# EAGLE design AETEL_Pocket_PoV (EAGLE 7.2.0)
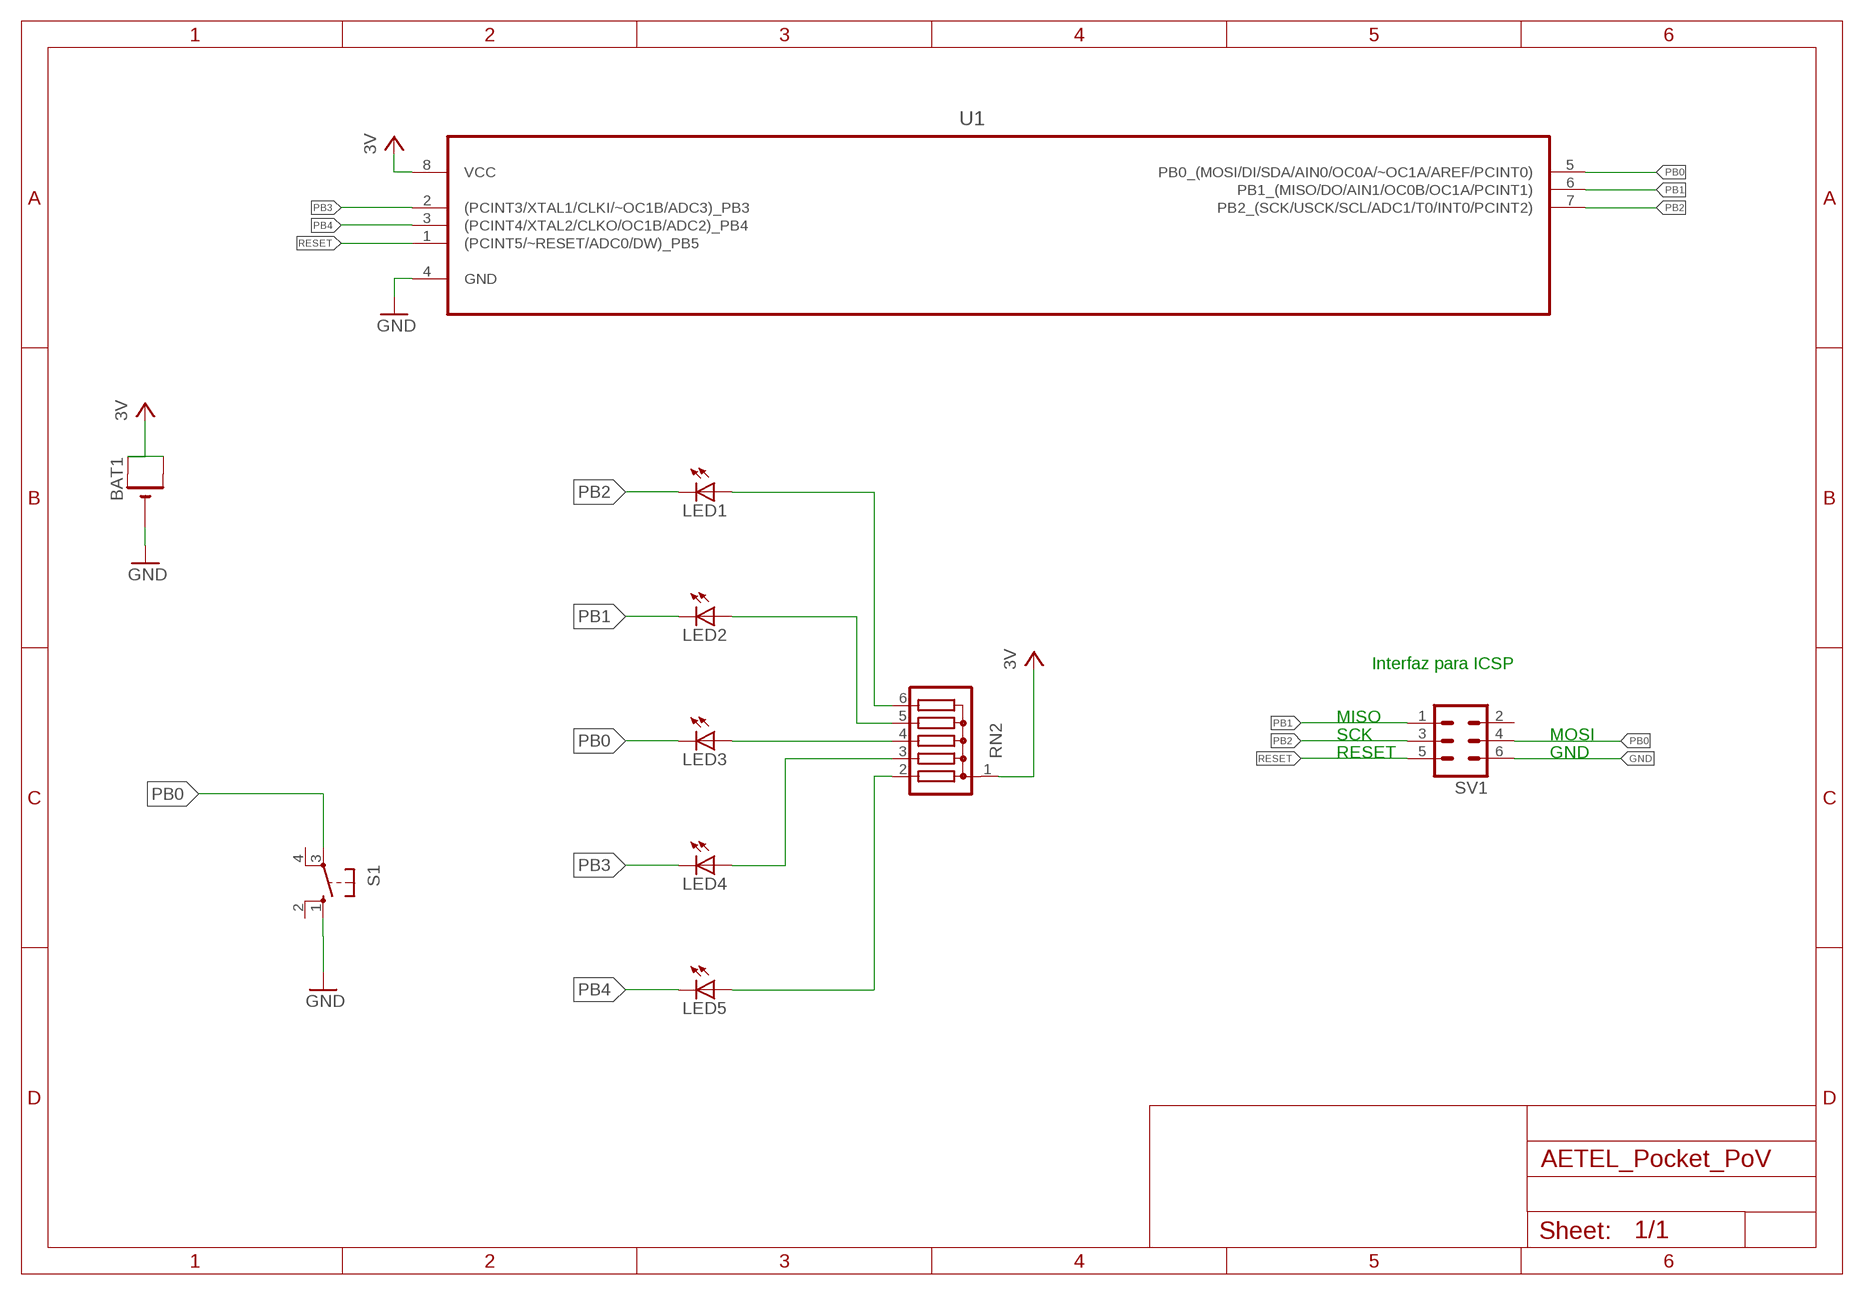
[diagram p0: schematic, sheet 1]

## Parts
BAT1  CR2032THM  [CR2032-THRU]
LED1  LEDSQUARE_LED5MM  [SQUARE_LED5MM]
LED2  LEDSQUARE_LED5MM  [SQUARE_LED5MM]
LED3  LEDSQUARE_LED5MM  [SQUARE_LED5MM]
LED4  LEDSQUARE_LED5MM  [SQUARE_LED5MM]
LED5  LEDSQUARE_LED5MM  [SQUARE_LED5MM]
RN2  G05R  [SIL6]
S1  10-XX  [B3F-10XX]
SV1  MA03-2  [MA03-2]
U1  ATTINY85-20PU  [DIP254P762X533-8]

## Nets
GND: BAT1.- S1.1(S) SV1.6 U1.4(GND)
N$1: LED3.A RN2.4
N$2: LED1.A RN2.6
N$3: LED2.A RN2.5
N$6: LED5.A RN2.2
N$7: LED4.A RN2.3
PB0: LED3.K(C) S1.3(P) SV1.4 U1.5(PB0_(MOSI/DI/SDA/AIN0/OC0A/~OC1A/AREF/PCINT0))
PB1: LED2.K(C) SV1.1 U1.6(PB1_(MISO/DO/AIN1/OC0B/OC1A/PCINT1))
PB2: LED1.K(C) SV1.3 U1.7(PB2_(SCK/USCK/SCL/ADC1/T0/INT0/PCINT2))
PB3: LED4.K(C) U1.2((PCINT3/XTAL1/CLKI/~OC1B/ADC3)_PB3)
PB4: LED5.K(C) U1.3((PCINT4/XTAL2/CLKO/OC1B/ADC2)_PB4)
RESET: SV1.5 U1.1((PCINT5/~RESET/ADC0/DW)_PB5)
VCC: BAT1.+1(+) BAT1.+2(+1) RN2.1 U1.8(VCC) ; supply symbol labelled 3V
Unconnected: S1.2(S1) S1.4(P1) SV1.2

## Notes on the sheet
- Interfaz para ICSP
- MISO
- SCK | MOSI
- RESET | GND

## Library data of the parts
BAT1 = adafruit:CR2032
LED1-LED5 = cbs_industrias_corp:LED: LED OSRAM: - CHIPLED LG R971, LG N971, LY N971, LG Q971, LY Q971, LO R971, LY R971 LH N974, LH R974 LS Q976, LO Q976, LY Q976 LO Q996 - Hyper CHIPLED LW Q18S LB Q993, LB Q99A, LB R99A - SideLED LS A670, LO A670, LY A670, LG A670, LP A670 LB A673, LV A673, LT A673, LW A673 LH A674 LY A675 LS A676, LA A676, LO A676, LY A676, LW A676 LS A679, LY A679, LG A679 - Hyper Micro SIDELED® LS Y876, LA Y876, LO Y876, LY Y876 LT Y87S - SmartLED LW L88C, LW L88S LB L89C, LB L89S, LG L890 LS L89K, LO L89K, LY L89K LS L896, LA L896, LO L896, LY L896 - TOPLED LS T670, LO T670, LY T670, LG T670, LP T670 LSG T670, LSP T670, LSY T670, LOP T670, LYG T670 LG T671, LOG T671, LSG T671 LB T673, LV T673, LT T673, LW T673 LH T674 LS T676, LA T676, LO T676, LY T676, LB T676, LH T676, LSB T676, LW T676 LB T67C, LV T67C, LT T67C, LS T67K, LO T67K, LY T67K, LW E67C LS E67B, LA E67B, LO E67B, LY E67B, LB E67C, LV E67C, LT E67C LW T67C LS T679, LY T679, LG T679 LS T770, LO T770, LY T770, LG T770, LP T770 LB T773, LV T773, LT T773, LW T773 LH T774 LS E675, LA E675, LY E675, LS T675 LS T776, LA T776, LO T776, LY T776, LB T776 LHGB T686 LT T68C, LB T68C - Hyper Mini TOPLED® LB M676 - Mini TOPLED Santana® LG M470 LS M47K, LO M47K, LY M47K Source: http://www.osram.convergy.de LUXEON: - LUMILED® LXK2-PW12-R00, LXK2-PW12-S00, LXK2-PW14-U00, LXK2-PW14-V00 LXK2-PM12-R00, LXK2-PM12-S00, LXK2-PM14-U00 LXK2-PE12-Q00, LXK2-PE12-R00, LXK2-PE12-S00, LXK2-PE14-T00, LXK2-PE14-U00 LXK2-PB12-K00, LXK2-PB12-L00, LXK2-PB12-M00, LXK2-PB14-N00, LXK2-PB14-P00, LXK2-PB14-Q00 LXK2-PR12-L00, LXK2-PR12-M00, LXK2-PR14-Q00, LXK2-PR14-R00 LXK2-PD12-Q00, LXK2-PD12-R00, LXK2-PD12-S00 LXK2-PH12-R00, LXK2-PH12-S00 LXK2-PL12-P00, LXK2-PL12-Q00, LXK2-PL12-R00 Source: www.luxeon.com KINGBRIGHT: KA-3528ASYC Source: www.kingbright.com
RN2 = resistor-sil:G05R: SIL RESISTOR; OC_FARNELL: unknown; OC_NEWARK: unknown
S1 = switch-omron:10-XX: OMRON SWITCH; MPN: B3F-1000; OC_FARNELL: 176432; OC_NEWARK: 36M3542
SV1 = con-lstb:MA03-2: PIN HEADER; OC_FARNELL: unknown; OC_NEWARK: unknown
U1 = Atmel_By_element14_Batch_1:ATTINY85-20PU: 8-bit Microcontroller with In-System Programmable Flash; MPN: ATTINY85-20PU; OC_FARNELL: 1455162; OC_NEWARK: 58M3796; PACKAGE: PDIP-8; SUPPLIER: Atmel

## Net classes
0 default: width 0.356 mm
1 power: width 0.61 mm

## Board
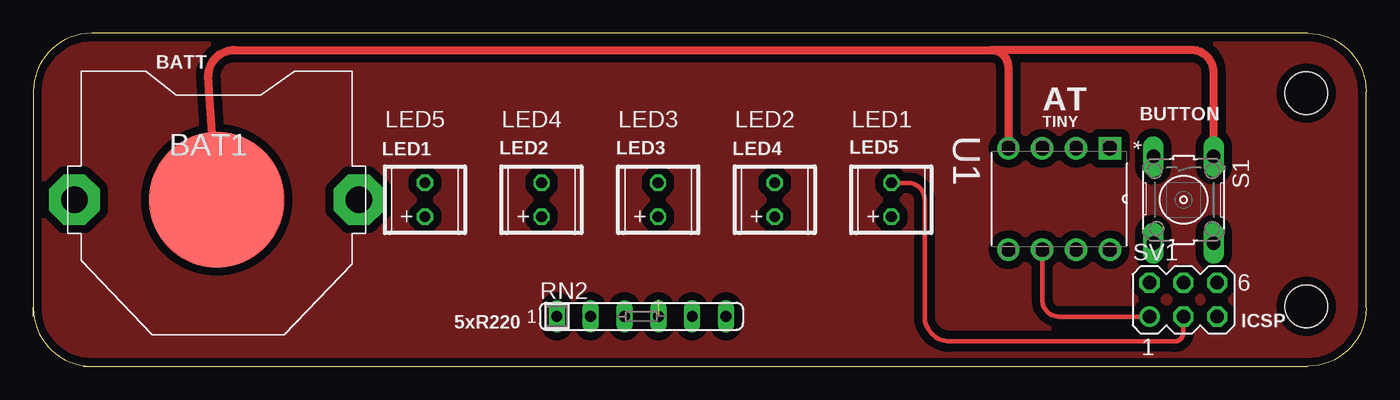
[diagram p1: board, top side]
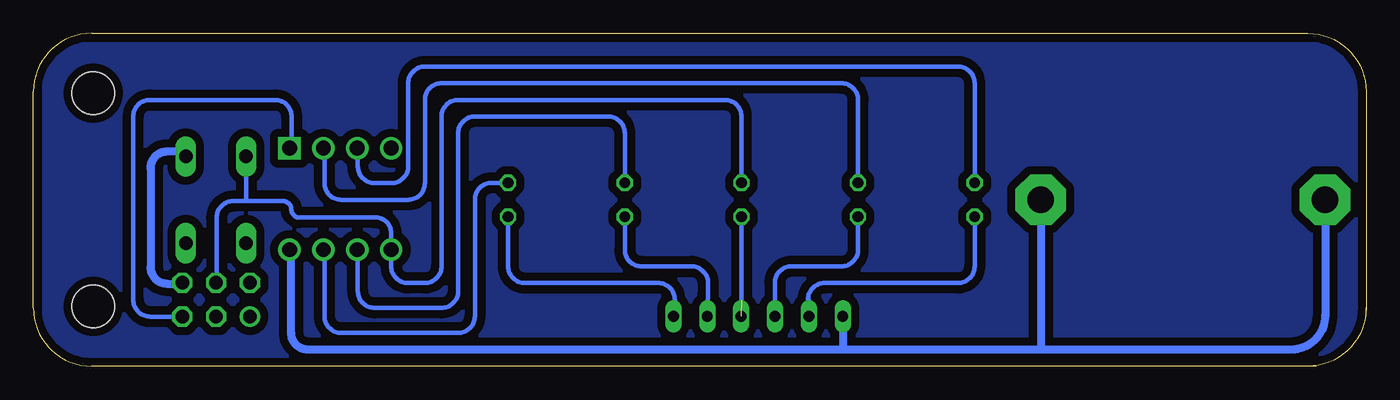
[diagram p2: board, bottom side, seen from below]

Size 100 x 25 mm. Coordinates in mm from the lower left corner, seen from the top.
Outline: 3.75,0 4.38,0
Outline: 4.38,0 95.62,0 arc90 100,4.38 100,20.62 arc90 95.62,25 4.38,25 arc90 0,20.62 0,4.38
Outline: 0,3.75 0,4.38
Outline: 0,4.38 arc90 4.38,0
Copper layers (1*16): Top 0.035mm / dielectric 1.6mm / Bottom 0.035mm
Design rules "Elecrow_2-layer_PCB_eagle_rule": minimum track width 6mil, minimum drill 12mil, track to track 6mil, track to pad 6mil, pad to pad 6mil, via to via 8mil, smd to smd 0mil, copper to edge 20mil, drill to drill 10mil, minimum pad ring 6mil, minimum via ring 6mil, stop-mask expansion 0mil, vias tented up to drill 100mil, thermal gap 10mil
Holes 3.2 mm at 95.5,20.5 95.5,4.5

### Footprints (pad centres in the part's own frame; a part is rotated, then mirrored left to right if it is on the bottom)
CR2032-THRU = drill 2 pad 3.81 octagon: +1 -10.668,0; +2 10.668,0 | smd 10.16 x 10.16: - 0,0
SQUARE_LED5MM = drill 0.813 octagon: A 0,-1.27; K 0,1.27
SIL6 = drill 0.813 long: 1 -6.35,0; 2 -3.81,0; 3 -1.27,0; 4 1.27,0; 5 3.81,0; 6 6.35,0
B3F-10XX = drill 1.016 long: 1 -3.251,2.261; 2 3.251,2.261; 3 -3.251,-2.261; 4 3.251,-2.261
MA03-2 = drill 1.016: 1 -2.54,-1.27 | drill 1.016 octagon: 2 -2.54,1.27; 3 0,-1.27; 4 0,1.27; 5 2.54,-1.27; 6 2.54,1.27
DIP254P762X533-8 = drill 1.118 square: 1 -7.62,7.62 | drill 1.118: 2 -7.62,5.08; 3 -7.62,2.54; 4 -7.62,0; 5 0,0; 6 0,2.54; 7 0,5.08; 8 0,7.62

### Placement (x,y rotation side)
BAT1  13.75,12.5 0 top
LED1  64.38,12.5 0 top
LED2  55.62,12.5 0 top
LED3  46.88,12.5 0 top
LED4  38.12,12.5 0 top
LED5  29.38,12.5 0 top
RN2  45.62,3.75 0 top
S1  86.3,12.49 270 top
SV1  86.28,4.99 0 top
U1  73.16,8.75 270 top

### Tracks (layer width: path | path; a pad name or v marks a point on that pad's centre or on a via)
GND
  Top 0.61: BAT1.- 13.12,21.77 arc-90 15.11,23.75 71.88,23.75 | 71.88,23.75 arc-90 73.12,22.5 arc-90 73.16,22.47 U1.4 | S1.1 88.56,22.07 arc90 86.88,23.75 71.88,23.75
  Bottom 0.61: S1.1 arc90 88.81,16.12 89.97,16.12 arc-90 91.2,14.88 91.2,7.44 arc-90 89.97,6.2 88.89,6.2 arc-90 SV1.6
N$1  (1 unrouted)
  Bottom 0.356: LED3.A 46.88,5
N$2
  Bottom 0.356: LED1.A 64.38,7.5 arc-90 63.12,6.25 53.12,6.25 arc90 51.88,5 51.88,3.85 arc90 RN2.6
N$3
  Bottom 0.356: LED2.A 55.62,8.75 arc-90 54.38,7.5 50.62,7.5 arc90 49.38,6.25 arc3 RN2.5
N$4
  pour Bottom (isolate 0.61): 0.62,4.38 arc90 4.38,0.62 95.62,0.62 arc90 99.38,4.38 99.38,20.62 arc90 95.62,24.38 4.38,24.38 arc90 0.62,20.62
N$5
  pour Top (isolate 0.61): 4.38,24.38 arc90 0.62,20.62 0.62,4.38 arc90 4.38,0.62 18.12,0.62 95.62,0.62 arc90 99.38,4.38 99.38,20.62 arc90 95.62,24.38 95,24.38
N$6
  Bottom 0.356: LED5.A 29.38,7.5 arc90 30.62,6.25 40.62,6.25 arc-90 41.88,5 arc90 41.81,4.94 RN2.2
N$7
  Bottom 0.356: LED4.A 38.12,8.75 arc90 39.38,7.5 43.12,7.5 arc-90 44.38,6.25 arc90 44.35,6.23 RN2.3
PB0
  Bottom 0.356: LED3.K 46.88,18.75 arc-90 48.12,20 68.12,20 arc-90 69.38,18.75 69.38,7.5 arc90 70.62,6.25 71.91,6.25 arc90 73.16,7.5 U1.5 73.16,10 arc-97 74.47,11.16 80.03,11.16 arc90 80.64,11.78 arc-90 81.27,12.4 84.03,12.4 | 84.03,12.4 85,12.4 arc-90 86.25,11.16 86.25,6.3 arc90 SV1.4 | S1.3 84.03,12.4
PB1
  Top 0.356: SV1.1 76.94,3.72 arc-90 75.7,4.96 U1.6 arc90 U1.6
  Bottom 0.356: 55.62,13.75 LED2.K 55.62,17.5 arc-90 56.88,18.75 66.88,18.75 arc-90 68.12,17.5 68.12,5.63 arc90 69.38,4.38 74.41,4.38 arc90 75.66,5.63 75.66,8.71 arc-90 U1.6 arc-90 75.66,8.79
PB2
  Top 0.356: SV1.3 86.28,2.52 arc-90 85.62,1.86 68.77,1.86 arc-90 66.88,3.75 66.88,12.5 arc90 65.61,13.77 LED1.K
  Bottom 0.356: 78.16,8.83 arc90 U1.7 arc90 78.16,8.67 78.16,3.75 arc-90 76.91,2.5 68.12,2.5 arc-90 66.88,3.75 66.88,12.5 arc90 65.61,13.77 LED1.K
PB3
  Bottom 0.356: 78.16,16.45 arc90 U1.2 arc90 78.16,16.29 78.16,13.75 arc-90 76.91,12.5 71.88,12.5 arc-90 70.62,13.75 70.62,20 arc90 69.38,21.25 39.38,21.25 arc90 38.12,20 LED4.K 38.12,13.75
PB4
  Bottom 0.356: 75.66,16.41 arc90 U1.3 arc90 75.66,16.33 75.66,15 arc-90 74.41,13.75 73.12,13.75 arc-90 71.88,15 71.88,21.25 arc90 70.62,22.5 30.62,22.5 arc90 29.38,21.25 LED5.K
RESET
  Bottom 0.356: SV1.5 91.22,3.72 arc90 92.5,5 92.5,18.75 arc90 91.25,20 81.88,20 arc90 80.62,18.75 80.62,16.52 arc90 U1.1
VCC
  Bottom 0.61: 39.38,1.25 79.41,1.25 arc90 80.66,2.5 80.66,8.63 arc-90 U1.8 | RN2.1 39.27,1.35 arc90 39.38,1.25 | BAT1.+1 3.08,3.79 arc90 5.62,1.25 24.38,1.25 | 24.38,1.25 39.38,1.25 | BAT1.+2 24.42,1.29 arc-90 24.38,1.25

### Text on the board
tSilk: BATT | AT | TINY | BUTTON | LED1 | LED2 | LED3 | LED4 | LED5 | 5xR220 | ICSP
201bmp: /Users/ricardosanz/Desktop/povdisplay/RS&CBS.BMP
202bmp: /Users/ricardosanz/Desktop/povdisplay/Sphera2016.BMP